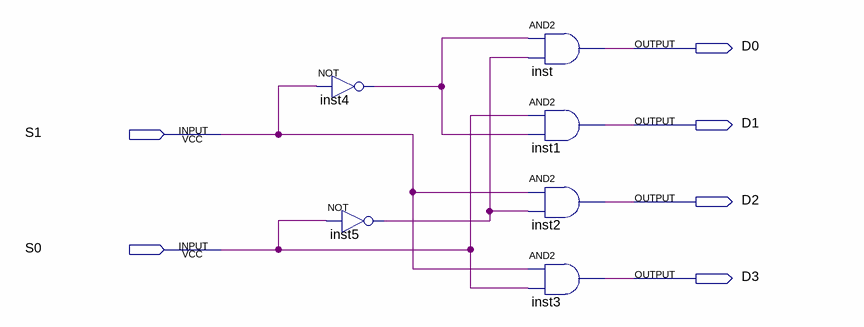
[diagram p0: schematic sheet]
// Quartus schematic Decoder.bdf as structural Verilog: 6 symbols, 6 pins
module Decoder (
  input  S1,
  input  S0,
  output D0,
  output D1,
  output D2,
  output D3
);

  wire inst4_out, inst5_out;

  not inst4 (inst4_out, S1);
  not inst5 (inst5_out, S0);
  and inst (D0, inst4_out, inst5_out);
  and inst1 (D1, S0, inst4_out);
  and inst2 (D2, S1, inst5_out);
  and inst3 (D3, S1, S0);
endmodule
